# EAGLE design ProgrammateurFilPilote_1.0 (EAGLE 6.5.0)
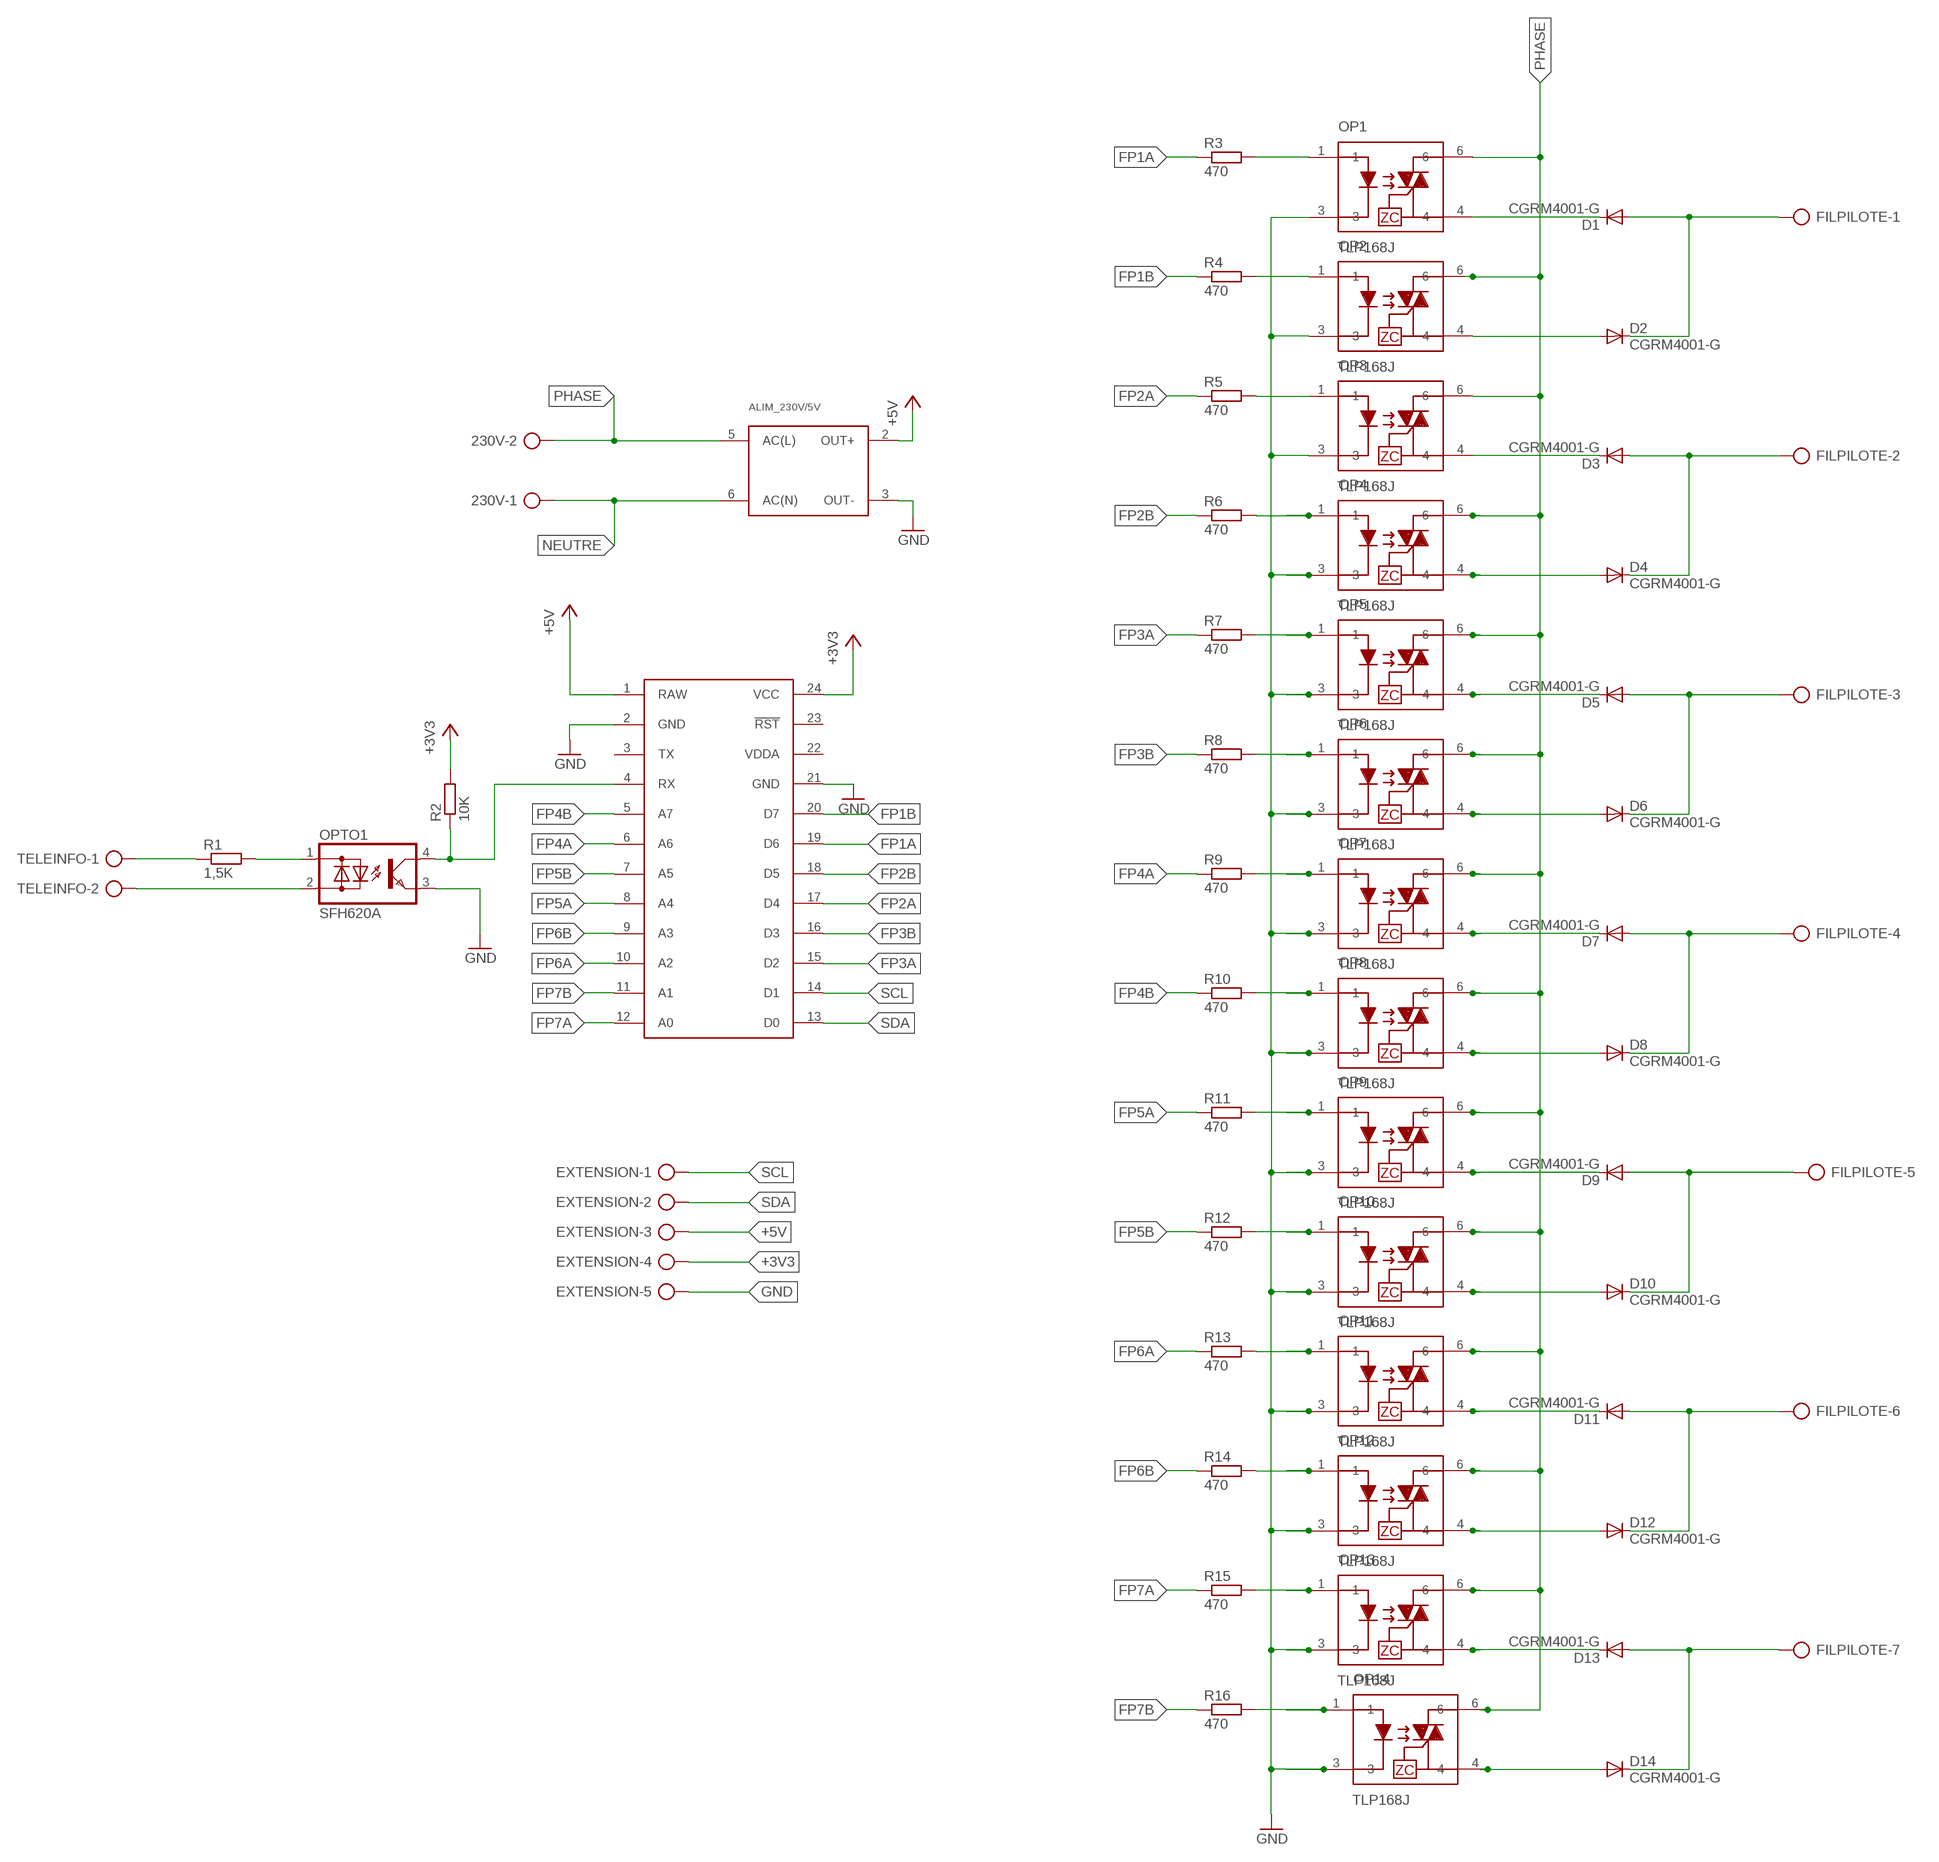
[diagram p0: schematic, sheet 1]

## Parts
230V  AK500/2  [AK500/2]
ALIM_230V/5V  TMLM04-SINGLE  [TMLM04]
D1  CGRM4001-G  [SOD-123_MINI-SMA]
D2  CGRM4001-G  [SOD-123_MINI-SMA]
D3  CGRM4001-G  [SOD-123_MINI-SMA]
D4  CGRM4001-G  [SOD-123_MINI-SMA]
D5  CGRM4001-G  [SOD-123_MINI-SMA]
D6  CGRM4001-G  [SOD-123_MINI-SMA]
D7  CGRM4001-G  [SOD-123_MINI-SMA]
D8  CGRM4001-G  [SOD-123_MINI-SMA]
D9  CGRM4001-G  [SOD-123_MINI-SMA]
D10  CGRM4001-G  [SOD-123_MINI-SMA]
D11  CGRM4001-G  [SOD-123_MINI-SMA]
D12  CGRM4001-G  [SOD-123_MINI-SMA]
D13  CGRM4001-G  [SOD-123_MINI-SMA]
D14  CGRM4001-G  [SOD-123_MINI-SMA]
EXTENSION  AK500/5  [AK500/5]
FILPILOTE  AK500/7  [AK500/7]
OP1  TLP168J  [MFSOP-4]
OP2  TLP168J  [MFSOP-4]
OP3  TLP168J  [MFSOP-4]
OP4  TLP168J  [MFSOP-4]
OP5  TLP168J  [MFSOP-4]
OP6  TLP168J  [MFSOP-4]
OP7  TLP168J  [MFSOP-4]
OP8  TLP168J  [MFSOP-4]
OP9  TLP168J  [MFSOP-4]
OP10  TLP168J  [MFSOP-4]
OP11  TLP168J  [MFSOP-4]
OP12  TLP168J  [MFSOP-4]
OP13  TLP168J  [MFSOP-4]
OP14  TLP168J  [MFSOP-4]
OPTO1  SFH620A  [DIL04]
R1  1,5K  R-EU_R1206  [R1206]
R2  10K  R-EU_R1206  [R1206]
R3  470  R-EU_R1206  [R1206]
R4  470  R-EU_R1206  [R1206]
R5  470  R-EU_R1206  [R1206]
R6  470  R-EU_R1206  [R1206]
R7  470  R-EU_R1206  [R1206]
R8  470  R-EU_R1206  [R1206]
R9  470  R-EU_R1206  [R1206]
R10  470  R-EU_R1206  [R1206]
R11  470  R-EU_R1206  [R1206]
R12  470  R-EU_R1206  [R1206]
R13  470  R-EU_R1206  [R1206]
R14  470  R-EU_R1206  [R1206]
R15  470  R-EU_R1206  [R1206]
R16  470  R-EU_R1206  [R1206]
SPARKCORE  SPARK_CORECORE  [SPARK_CORE]
TELEINFO  AK500/2  [AK500/2]

## Nets
+3V3: EXTENSION.4 R2.2 SPARKCORE.24(VCC)
+5V: ALIM_230V/5V.2(OUT+) EXTENSION.3 SPARKCORE.1(RAW)
FP1A: R3.1 SPARKCORE.19(D6)
FP1B: R4.1 SPARKCORE.20(D7)
FP2A: R5.1 SPARKCORE.17(D4)
FP2B: R6.1 SPARKCORE.18(D5)
FP3A: R7.1 SPARKCORE.15(D2)
FP3B: R8.1 SPARKCORE.16(D3)
FP4A: R9.1 SPARKCORE.6(A6)
FP4B: R10.1 SPARKCORE.5(A7)
FP5A: R11.1 SPARKCORE.8(A4)
FP5B: R12.1 SPARKCORE.7(A5)
FP6A: R13.1 SPARKCORE.10(A2)
FP6B: R14.1 SPARKCORE.9(A3)
FP7A: R15.1 SPARKCORE.12(A0)
FP7B: R16.1 SPARKCORE.11(A1)
GND: ALIM_230V/5V.3(OUT-) EXTENSION.5 OP1.3 OP2.3 OP3.3 OP4.3 OP5.3 OP6.3 OP7.3 OP8.3 OP9.3 OP10.3 OP11.3 OP12.3 OP13.3 OP14.3 OPTO1.3(E) SPARKCORE.2(GND) SPARKCORE.21(GND)
N$1: D1.C OP1.4
N$2: D2.A OP2.4
N$3: OPTO1.2(AC2) TELEINFO.2
N$4: OPTO1.1(AC1) R1.2
N$5: R1.1 TELEINFO.1
N$6: OPTO1.4(C) R2.1 SPARKCORE.4(RX)
N$7: OP1.1 R3.2
N$8: OP2.1 R4.2
N$9: OP3.1 R5.2
N$10: OP4.1 R6.2
N$11: OP5.1 R7.2
N$12: OP6.1 R8.2
N$13: OP7.1 R9.2
N$14: OP8.1 R10.2
N$19: OP9.1 R11.2
N$22: D3.C OP3.4
N$23: D3.A D4.C FILPILOTE.2
N$24: D5.C OP5.4
N$25: D4.A OP4.4
N$26: D7.C OP7.4
N$27: D5.A D6.C FILPILOTE.3
N$28: D1.A D2.C FILPILOTE.1
N$29: D6.A OP6.4
N$30: D7.A D8.C FILPILOTE.4
N$31: D8.A OP8.4
N$32: OP10.1 R12.2
N$33: OP13.1 R15.2
N$34: OP14.1 R16.2
N$42: D9.C OP9.4
N$43: D11.C OP11.4
N$44: D13.C OP13.4
N$46: D9.A D10.C FILPILOTE.5
N$47: OP11.1 R13.2
N$48: OP12.1 R14.2
N$49: D10.A OP10.4
N$50: D11.A D12.C FILPILOTE.6
N$51: D12.A OP12.4
N$52: D13.A D14.C FILPILOTE.7
N$53: D14.A OP14.4
NEUTRE: 230V.1 ALIM_230V/5V.6(AC(N))
PHASE: 230V.2 ALIM_230V/5V.5(AC(L)) OP1.6 OP2.6 OP3.6 OP4.6 OP5.6 OP6.6 OP7.6 OP8.6 OP9.6 OP10.6 OP11.6 OP12.6 OP13.6 OP14.6
SCL: EXTENSION.1 SPARKCORE.14(D1)
SDA: EXTENSION.2 SPARKCORE.13(D0)
Unconnected: SPARKCORE.3(TX) SPARKCORE.23(!RST)

## Power pins joined to a net without a drawn wire
VDDA: SPARKCORE.22(VDDA)

## Library data of the parts
230V TELEINFO = con-ptr500:AK500/2: CONNECTOR; OC_FARNELL: unknown; OC_NEWARK: unknown
ALIM_230V/5V = Traco-TMLM04:TMLM04-SINGLE
D1-D14 = diode:CGRM400*-G: Molded plasitc,JEDEC SOD-123/Mini SMA Source: Comchip CGRM4001-G.pdf
EXTENSION = con-ptr500:AK500/5: CONNECTOR; OC_FARNELL: unknown; OC_NEWARK: unknown
FILPILOTE = con-ptr500:AK500/7: CONNECTOR; OC_FARNELL: unknown; OC_NEWARK: unknown
OP1-OP14 = TLP168J:TLP168J
OPTO1 = optocoupler:SFH620: Optocoupler, Phototransistor Output, AC Input Source: http://www.vishay.com/docs/83675/sfh620.pdf; MPN: SFH620A-2; OC_FARNELL: 1469594; OC_NEWARK: 97K9546
R1-R16 = resistor:R-EU_: RESISTOR, European symbol
SPARKCORE = Spark:SPARK_CORE

## Net classes
0 default: width 0.305 mm, drill 0.508 mm, clearance 0.254 mm

## Board
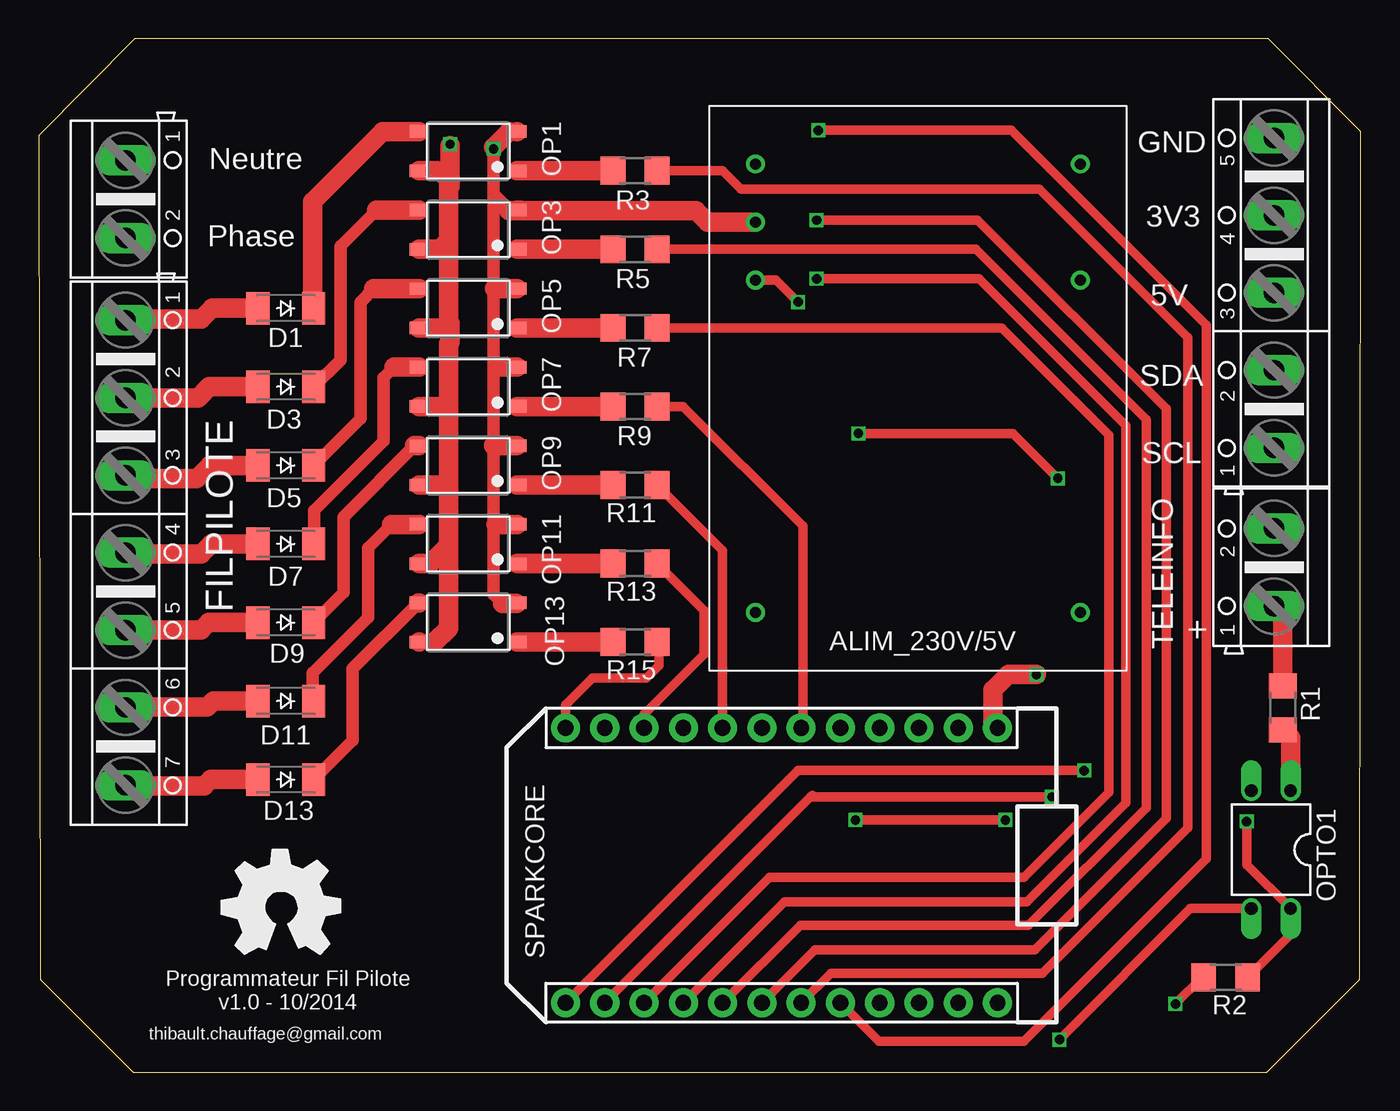
[diagram p1: board, top side]
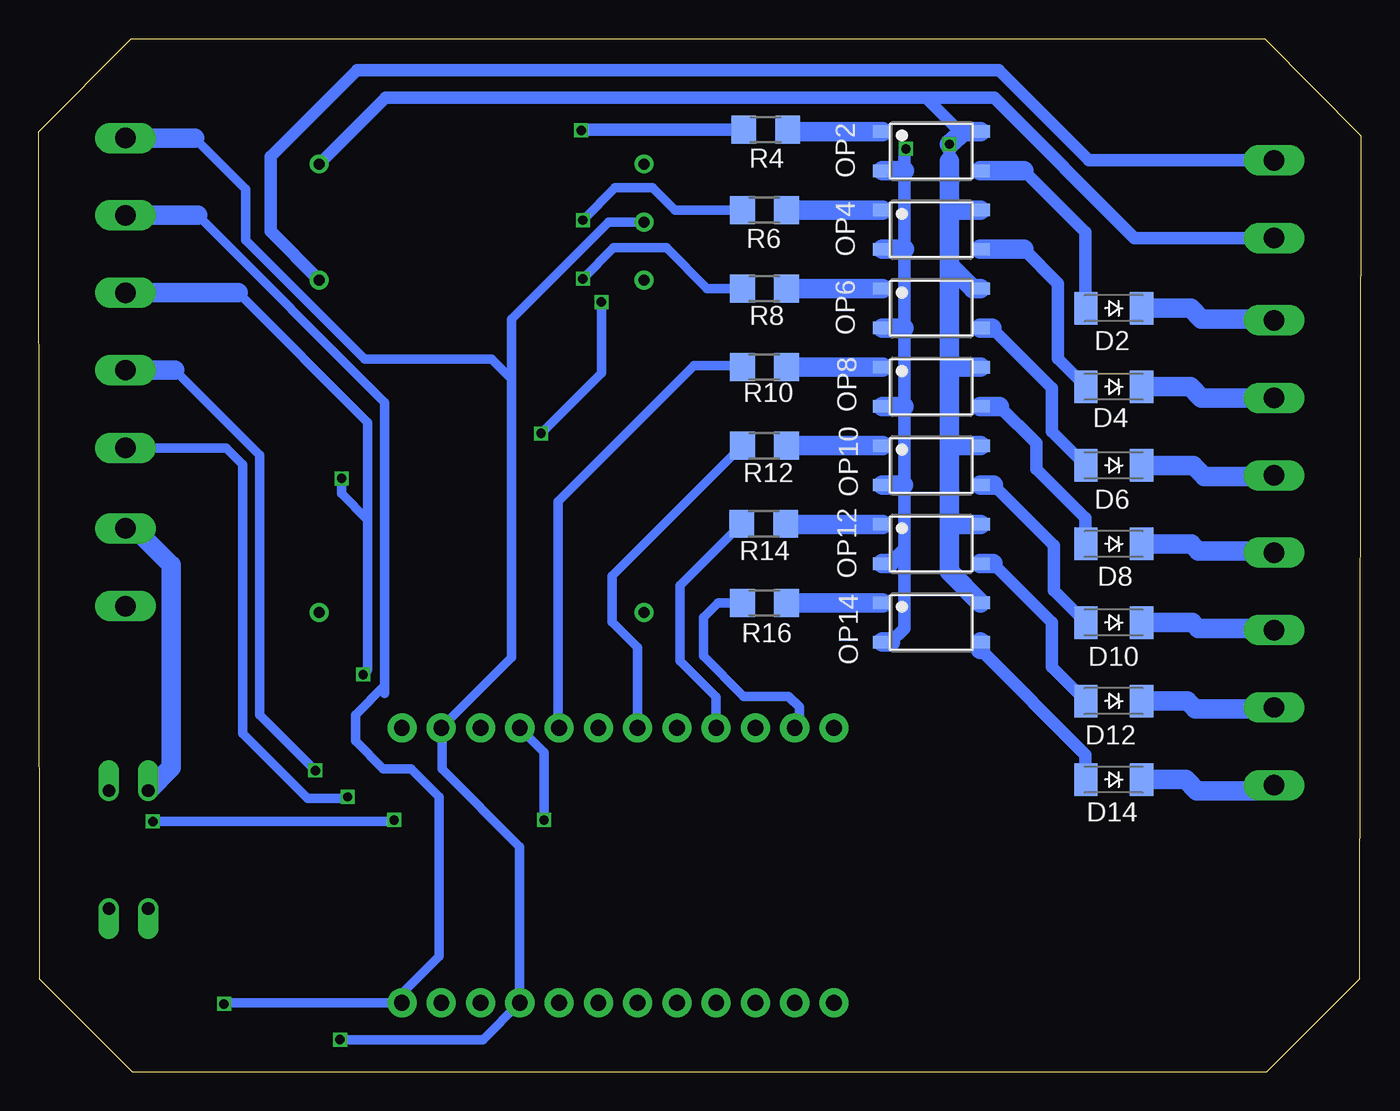
[diagram p2: board, bottom side, seen from below]

Size 85.49 x 66.83 mm. Coordinates in mm from the lower left corner, seen from the top.
Outline: 0,60.54 0.12,6.01 6.12,0 79.41,0 85.41,5.99 85.49,60.82 79.49,66.83 6.2,66.83 0,60.54
Copper layers (1*16): Top 0.035mm / dielectric 1.5mm / Bottom 0.035mm
Design rules "Elecrow_2-layer_eagle_rule": minimum track width 6mil, minimum drill 12mil, track to track 6mil, track to pad 6mil, pad to pad 6mil, via to via 6mil, smd to smd 0mil, copper to edge 10mil, drill to drill 10mil, minimum pad ring 10mil, minimum via ring 6mil, stop-mask expansion 2mil, vias tented up to drill 100mil, thermal gap 10mil

### Footprints (pad centres in the part's own frame; a part is rotated, then mirrored left to right if it is on the bottom)
AK500/2 = drill 1.321 long: 1 -2.515,0; 2 2.515,0
TMLM04 = drill 0.7: 1 3,3.75; 2 3,25.25; 3 3,29; 4 3,32.75; 5 24,32.75; 6 24,25.25; 7 24,3.75
SOD-123_MINI-SMA = smd 1.5 x 2.1: A 1.8,0; C -1.8,0
AK500/5 = drill 1.321 long: 1 -10.033,0; 2 -5.004,0; 3 0,0; 4 5.004,0; 5 10.008,0
AK500/7 = drill 1.321 long: 1 -15.037,0; 2 -10.008,0; 3 -5.004,0; 4 0,0; 5 5.004,0; 6 10.008,0; 7 15.037,0
MFSOP-4 = smd 0.8 x 1.2: 1 2.54,0; 3 0,0; 4 0,-6.35; 6 2.54,-6.35
DIL04 = drill 0.813 offset: 1 -1.27,-3.81; 2 1.27,-3.81; 3 1.27,3.81; 4 -1.27,3.81
R1206 = smd 1.6 x 1.803: 1 -1.422,0; 2 1.422,0
SPARK_CORE = drill 1.016 pad 1.88: 1 -8.89,13.97; 2 -8.89,11.43; 3 -8.89,8.89; 4 -8.89,6.35; 5 -8.89,3.81; 6 -8.89,1.27; 7 -8.89,-1.27; 8 -8.89,-3.81; 9 -8.89,-6.35; 10 -8.89,-8.89; 11 -8.89,-11.43; 12 -8.89,-13.97; 13 8.89,-13.97; 14 8.89,-11.43; 15 8.89,-8.89; 16 8.89,-6.35; 17 8.89,-3.81; 18 8.89,-1.27; 19 8.89,1.27; 20 8.89,3.81; 21 8.89,6.35; 22 8.89,8.89; 23 8.89,11.43; 24 8.89,13.97

### Placement (x,y rotation side)
230V  5.62,56.45 270 top
ALIM_230V/5V  43.35,25.97 0 top
D1  15.97,49.39 180 top
D2  15.97,49.39 180 bottom
D3  15.97,44.31 180 top
D4  15.97,44.31 180 bottom
D5  15.97,39.23 180 top
D6  15.97,39.23 180 bottom
D7  15.97,34.16 180 top
D8  15.97,34.16 180 bottom
D9  15.97,29.07 180 top
D10  15.97,29.07 180 bottom
D11  15.97,23.99 180 top
D12  15.97,23.99 180 bottom
D13  15.97,18.91 180 top
D14  15.97,18.91 180 bottom
EXTENSION  79.89,50.4 90 top
FILPILOTE  5.62,33.59 270 top
OP1  30.94,60.82 270 top
OP2  30.94,58.28 90 bottom
OP3  30.94,55.74 270 top
OP4  30.94,53.2 90 bottom
OP5  30.94,50.66 270 top
OP6  30.94,48.12 90 bottom
OP7  30.94,45.59 270 top
OP8  30.94,43.05 90 bottom
OP9  30.94,40.5 270 top
OP10  30.94,37.96 90 bottom
OP11  30.94,35.42 270 top
OP12  30.94,32.88 90 bottom
OP13  30.94,30.34 270 top
OP14  30.94,27.8 90 bottom
OPTO1  79.68,14.38 180 top
R1  80.44,23.55 270 top
R2  76.75,6.14 180 top
R3  38.56,58.28 180 top
R4  38.48,60.93 0 bottom
R5  38.56,53.2 180 top
R6  38.56,55.74 0 bottom
R7  38.56,48.12 180 top
R8  38.56,50.66 0 bottom
R9  38.56,43.05 180 top
R10  38.56,45.59 0 bottom
R11  38.56,37.96 180 top
R12  38.56,40.5 0 bottom
R13  38.56,32.88 180 top
R14  38.61,35.46 0 bottom
R15  38.56,27.8 180 top
R16  38.56,30.34 0 bottom
SPARKCORE  48.03,13.37 270 top
TELEINFO  79.89,32.65 90 top

### Tracks (layer width: path | path; a pad name or v marks a point on that pad's centre or on a via)
+3V3  (via drill 0.6)
  Top 0.61: R2.2 75.25,6.14 v73.51,4.4
  Bottom 0.61: v73.51,4.4 73.43,4.47 SPARKCORE.24 62,5.11 59.61,7.5 59.61,17.8 61.41,19.6 63.21,19.6 65.01,21.4 65.01,23.1 63.11,25 | 75.21,55.4 63.11,43.3 63.11,25 | 63.11,25 63.11,24.5
  Bottom 1.27: EXTENSION.4 75.21,55.4
+5V  (via drill 0.6)
  Top 0.61: ALIM_230V/5V.2 47.69,51.22 v49.11,49.8 | v53.01,41.3 63.01,41.3 v65.91,38.4
  Top 1.27: v64.51,25.7 62.71,25.7 61.71,24.7 61.71,22.55 SPARKCORE.1
  Bottom 0.61: 72.61,50.4 64.21,42 64.21,35.7 | 64.21,35.7 64.21,26 v64.51,25.7 | v49.11,49.8 49.11,45.2 v53.01,41.3 | v65.91,38.4 65.91,37.4 64.21,35.7
  Bottom 1.27: EXTENSION.3 72.61,50.4
FP1A
  Top 0.61: R3.1 44.22,58.28 45.41,57.1 64.71,57.1 74.31,47.5 74.31,15.8 64.91,6.4 51.23,6.4 SPARKCORE.19
FP1B  (via drill 0.6)
  Top 0.61: v50.41,60.9 62.91,60.9 75.51,48.3 75.51,13.8 63.71,2 54.32,2 SPARKCORE.20
  Bottom 0.61: 50.38,60.93 v50.41,60.9
  Bottom 0.813: 39.81,61.1 39.9,61 R4.1 50.38,60.93
FP2A
  Top 0.61: R5.1 60.6,53.2 71.61,42.2 71.61,17.1 64.01,9.5 49.25,9.5 SPARKCORE.17
FP2B  (via drill 0.6)
  Top 0.61: v50.31,55.1 60.71,55.1 72.91,42.9 72.91,16.4 64.41,7.9 50.19,7.9 SPARKCORE.18
  Bottom 0.61: R6.1 44.35,55.74 45.81,57.2 48.21,57.2 v50.31,55.1
FP3A
  Top 0.61: R7.1 62.28,48.12 69.21,41.2 69.21,18.1 63.71,12.6 47.27,12.6 SPARKCORE.15
FP3B  (via drill 0.6)
  Top 0.61: v50.31,51.3 60.81,51.3 70.31,41.8 70.31,17.4 63.91,11 48.21,11 SPARKCORE.16
  Bottom 0.61: R8.1 42.27,50.66 44.91,53.3 48.31,53.3 v50.31,51.3
FP4A
  Top 0.61: R9.1 41.66,43.05 49.41,35.3 49.41,22.36 SPARKCORE.6
FP4B
  Bottom 0.61: R10.1 40.09,45.59 40.21,45.7 43.11,45.7 51.91,36.9 51.91,22.32 SPARKCORE.5
FP5A
  Top 0.61: SPARKCORE.8 44.22,33.73 R11.1
FP5B
  Bottom 0.61: SPARKCORE.7 46.76,27.45 48.41,29.1 48.41,32.08 R12.1
FP6A
  Top 0.61: SPARKCORE.10 39.14,23.13 43.01,27 43.01,29.86 R13.1
FP6B
  Bottom 0.61: SPARKCORE.9 41.68,24.27 44.01,26.6 44.01,31.48 R14.1
FP7A
  Top 0.61: SPARKCORE.12 34.06,23.75 35.81,25.5 39.31,25.5 40.11,26.3 40.11,27.68 R15.1
FP7B
  Bottom 0.61: R16.1 41.56,30.34 42.51,29.4 42.51,26.9 39.91,24.3 37.01,24.3 36.31,23.6 36.31,22.55 SPARKCORE.11
GND  (via drill 0.6)
  Top 0.61: OPTO1.3 74.48,10.58 v66.01,2.1 | 30.41,55.7 29.41,56.7
  Top 0.813: OP3.3 30.97,55.74 31.19,55.97 | 30.99,55.7 30.51,55.7 29.41,56.8 v29.41,59.7 | v29.41,59.7 29.41,60 30.21,60.8 30.41,60.8 30.92,60.8 | 29.41,56.7 29.41,50.6 | 29.41,50.6 29.41,45.3 | 29.41,45.3 29.41,40.5 | 29.41,40.5 29.41,35.6 | 29.41,35.6 29.41,30.9 30.01,30.3 | 30.9,30.3 OP13.3 | 29.58,35.42 29.41,35.6 | 29.41,40.5 | 29.69,45.59 29.41,45.3 | 29.47,50.66 29.41,50.6 | v29.41,59.7 29.41,59.8
  Top 1.27: ALIM_230V/5V.3 43.24,54.97 42.51,55.7 30.99,55.7 | 30.99,55.7 OP3.3 | 30.92,60.8 OP1.3 | 30.99,55.7 30.41,55.7 | 30.01,30.3 30.9,30.3 | OP11.3 29.58,35.42 | OP9.3 29.41,40.5 | OP7.3 29.69,45.59 | OP5.3 29.47,50.66 | 29.41,59.8 30.41,60.8
  Bottom 0.61: ALIM_230V/5V.3 48.64,54.97 54.91,48.7 54.91,44.8 | 54.91,44.8 54.91,26.81 SPARKCORE.2 59.41,22.2 59.41,19.6 54.38,14.58 SPARKCORE.21 56.76,2.1 v66.01,2.1 | 75.42,60.41 72.11,57.1 72.11,53.8 64.41,46.1 56.21,46.1 54.91,44.8
  Bottom 0.813: 30.4,27.8 29.51,28.7 29.51,33.9 | 29.51,33.9 29.51,37.9 | 29.51,37.9 29.51,43 | 29.51,43 29.51,48.1 | 29.51,48.1 29.51,53.2 | 29.51,53.2 29.51,58.3 | 29.51,58.3 29.51,59.6 v29.41,59.7 | 30.52,32.88 29.51,33.9 | 29.57,37.96 29.51,37.9 | 29.55,43.05 29.51,43 | 29.53,48.12 29.51,48.1 | 29.51,53.2 | 29.52,58.28 29.51,58.3
  Bottom 1.27: EXTENSION.5 75.42,60.41 | OP14.3 30.4,27.8 | OP12.3 30.52,32.88 | OP10.3 29.57,37.96 | OP8.3 29.55,43.05 | OP6.3 29.53,48.12 | OP4.3 29.51,53.2 | OP2.3 29.52,58.28
N$1
  Top 0.813: 17.71,49.46 D1.C
  Top 1.27: OP1.4 22.23,60.82 17.71,56.3 17.71,49.46
N$2
  Bottom 0.813: 21.78,58.28 17.8,54.31 17.8,49.42 D2.A
  Bottom 1.27: OP2.4 21.78,58.28
N$3
  Bottom 0.61: TELEINFO.2 79.27,35.16
  Bottom 1.27: 79.27,35.16 76.91,32.8 76.91,19.7 OPTO1.2
N$4
  Top 0.813: 80.95,21.62 R1.2
  Top 1.27: OPTO1.1 80.95,21.62
N$5
  Top 0.61: 80.44,29.58 TELEINFO.1
  Top 1.27: R1.1 80.44,29.58
N$6  (via drill 0.6)
  Top 0.61: v62.51,16.3 v52.81,16.3 | R2.1 80.95,8.91 OPTO1.4 78.11,13.42 v78.11,16.2
  Bottom 0.61: v78.11,16.2 62.61,16.2 v62.51,16.3 | v52.81,16.3 52.81,20.68 SPARKCORE.4
N$7
  Top 1.27: OP1.1 R3.2
N$8
  Bottom 0.813: 36.95,60.82 R4.2
  Bottom 1.27: OP2.1 36.95,60.82
N$9
  Top 1.27: OP3.1 R5.2
N$10
  Bottom 1.27: OP4.1 R6.2
N$11
  Top 1.27: OP5.1 R7.2
N$12
  Bottom 1.27: OP6.1 R8.2
N$13
  Top 1.27: OP7.1 R9.2
N$14
  Bottom 1.27: R10.2 OP8.1
N$19
  Top 1.27: OP9.1 R11.2
N$22
  Top 0.813: 21.85,55.74 19.51,53.4 19.51,46.05 D3.C
  Top 1.27: OP3.4 21.85,55.74
N$23
  Top 0.813: FILPILOTE.2
  Top 1.27: D4.C 11.02,44.31 10.31,43.6 FILPILOTE.2
  Bottom 0.813: FILPILOTE.2
  Bottom 1.27: D4.C 11.02,44.31 10.31,43.6 FILPILOTE.2
N$24
  Top 0.813: 21.67,50.66 20.81,49.8 20.81,42.27 D5.C
  Top 1.27: OP5.4 21.67,50.66
N$25
  Bottom 0.813: 21.8,53.2 19.59,51 19.59,46.13 D4.A
  Bottom 1.27: OP4.4 21.8,53.2
N$26
  Top 0.813: 22.99,45.59 22.31,44.9 22.31,40.8 17.81,36.3 17.81,34.19 D7.C
  Top 1.27: OP7.4 22.99,45.59
N$27
  Top 0.813: 5.81,38.4 FILPILOTE.3
  Top 1.27: D6.C 11.04,39.23 10.21,38.4 5.81,38.4
  Bottom 0.813: 5.71,38.5 FILPILOTE.3
  Bottom 1.27: D6.C 10.84,39.23 10.11,38.5 5.71,38.5
N$28
  Top 0.813: 5.69,48.7 FILPILOTE.1
  Top 1.27: D2.C 11.2,49.39 10.51,48.7 5.69,48.7
  Bottom 0.813: 5.69,48.7 FILPILOTE.1
  Bottom 1.27: D2.C 11,49.39 10.31,48.7 5.69,48.7
N$29
  Bottom 0.813: 23.86,48.12 19.97,44.24 19.97,41.43 D6.A
  Bottom 1.27: OP6.4 23.86,48.12
N$30
  Top 0.813: 5.71,33.5 FILPILOTE.4
  Top 1.27: D8.C 11.16,34.16 10.51,33.5 5.71,33.5
  Bottom 0.813: 5.73,33.7 FILPILOTE.4
  Bottom 1.27: D8.C 10.96,34.16 10.51,33.7 5.73,33.7
N$31
  Bottom 0.813: 23.37,43.05 20.99,40.67 20.99,39.01 17.8,35.82 17.8,34.18 D8.A
  Bottom 1.27: OP8.4 23.37,43.05
N$32
  Bottom 1.27: R12.2 OP10.1
N$33
  Top 1.27: OP13.1 R15.2
N$34
  Bottom 0.813: R16.2 37.18,30.34 | OP14.1
  Bottom 1.27: 37.18,30.34 OP14.1
N$42
  Top 0.813: 24.31,40.5 19.71,35.9 19.71,31.01 D9.C
  Top 1.27: OP9.4 24.31,40.5
N$43
  Top 0.813: 22.83,35.42 21.31,33.9 21.31,29.4 17.71,25.8 17.71,24.06 D11.C
  Top 1.27: OP11.4 22.83,35.42
N$44
  Top 0.813: 24.55,30.34 20.31,26.1 20.31,21.45 D13.C
  Top 1.27: OP13.4 24.55,30.34
N$46
  Top 0.813: 5.63,28.6 FILPILOTE.5
  Top 1.27: D10.C 10.98,29.07 10.51,28.6 5.63,28.6
  Bottom 0.813: 5.73,28.7 FILPILOTE.5
  Bottom 1.27: D10.C 10.88,29.07 10.51,28.7 5.73,28.7
N$47
  Top 1.27: OP11.1 R13.2
N$48
  Bottom 0.813: 37.15,35.42 R14.2
  Bottom 1.27: OP12.1 37.15,35.42
N$49
  Bottom 0.813: 23.77,37.96 19.84,34.04 19.84,31.14 D10.A
  Bottom 1.27: OP10.4 23.77,37.96
N$50
  Top 0.813: 5.64,23.6 FILPILOTE.6
  Top 1.27: D12.C 11.3,23.99 10.91,23.6 5.64,23.6
  Bottom 0.813: 5.7,23.5 FILPILOTE.6
  Bottom 1.27: D12.C 11.2,23.99 10.71,23.5 5.7,23.5
N$51
  Bottom 0.813: 23.79,32.88 19.97,29.07 19.97,26.19 D12.A
  Bottom 1.27: OP12.4 23.79,32.88
N$52
  Top 0.813: 5.67,18.5 FILPILOTE.7
  Top 1.27: D14.C 11.12,18.91 10.71,18.5 5.67,18.5
  Bottom 0.813: 5.97,18.2 FILPILOTE.7
  Bottom 1.27: D14.C 11.32,18.91 10.61,18.2 5.97,18.2
N$53
  Bottom 0.813: 24.59,27.31 17.8,20.52 17.8,18.95 D14.A
  Bottom 1.27: OP14.4 24.59,27.31
NEUTRE
  Bottom 0.813: 230V.1 17.57,58.96 23.41,64.8 64.91,64.8 70.51,59.2 70.51,54.38 ALIM_230V/5V.6
PHASE  (via drill 0.6)
  Top 0.813: 26.51,57.5 25.72,58.28 25.72,58.18 26.61,57.3 | 25.61,27.8 OP13.6 | 25.97,37.96 26.51,38.5 | 26.51,43.5 26.05,43.05 26.55,43.05 26.61,43.1 | 25.83,48.12 26.51,48.8 26.51,47.1 26.61,47.2 | 26.41,60 v26.61,60 26.61,59.9 | 26.33,48.12 26.61,48.4
  Top 1.27: OP13.6 | OP1.6 25.72,58.28 | 26.51,57.5 26.51,53.8 | 26.51,53.8 26.51,48.8 | 26.51,47.1 26.51,43.5 26.51,38.5 26.51,34.1 | 26.51,34.1 26.51,28.7 25.61,27.8 | OP11.6 25.29,32.88 26.51,34.1 | OP7.6 26.05,43.05 | OP5.6 25.83,48.12 26.33,48.12 | OP3.6 25.91,53.2 26.51,53.8 | 26.61,57.3 26.61,59.9 | 26.61,48.4 26.61,47.2 | OP9.6 25.97,37.96
  Bottom 0.813: 25.95,55.74 26.61,56.4 | 26.61,58.9 v26.61,60 | 26.6,40.5 26.61,40.5 | 26.49,45.59 26.61,45.7 | 26.58,35.42 26.61,35.4 | 230V.2 14.64,53.93 23.71,63 28.11,63 | 28.11,63 63.07,63 ALIM_230V/5V.5 | OP2.6 25.93,60.82 28.11,63
  Bottom 1.27: OP14.6 26.61,32.36 26.61,35.4 26.61,40.5 26.61,45.7 26.61,52.2 | OP2.6 25.68,60.82 v26.61,60 | 26.61,58.9 26.61,56.4 26.61,52.2 | OP6.6 25.07,50.66 26.61,52.2 | OP4.6 25.95,55.74 | OP10.6 26.6,40.5 | OP8.6 26.49,45.59 | OP12.6 26.58,35.42
SCL  (via drill 0.6)
  Top 0.61: 50.03,17.9 49.93,17.8 | SPARKCORE.14 49.92,17.79 49.93,17.8 | v65.51,17.8 49.93,17.8
  Bottom 0.61: EXTENSION.1 73.38,40.37 72.31,39.3 72.31,21.9 68.11,17.7 65.61,17.7 v65.51,17.8
SDA  (via drill 0.6)
  Top 0.61: v67.61,19.5 49.09,19.5 SPARKCORE.13
  Bottom 0.61: 76.71,45.4 71.21,39.9 71.21,23.1 v67.61,19.5
  Bottom 1.27: EXTENSION.2 76.71,45.4

### Text on the board
tPlace: Programmateur Fil Pilote / v1.0 - 10/2014 | thibault.chauffage@gmail.com
tNames: GND | Neutre | 3V3 | Phase | 5V | SDA | SCL | +